# Altium schematic sheet suns_wifi_egse_top_connectors.SchDoc: Top
size A4; SheetNumber: 1; SheetTotal: 1
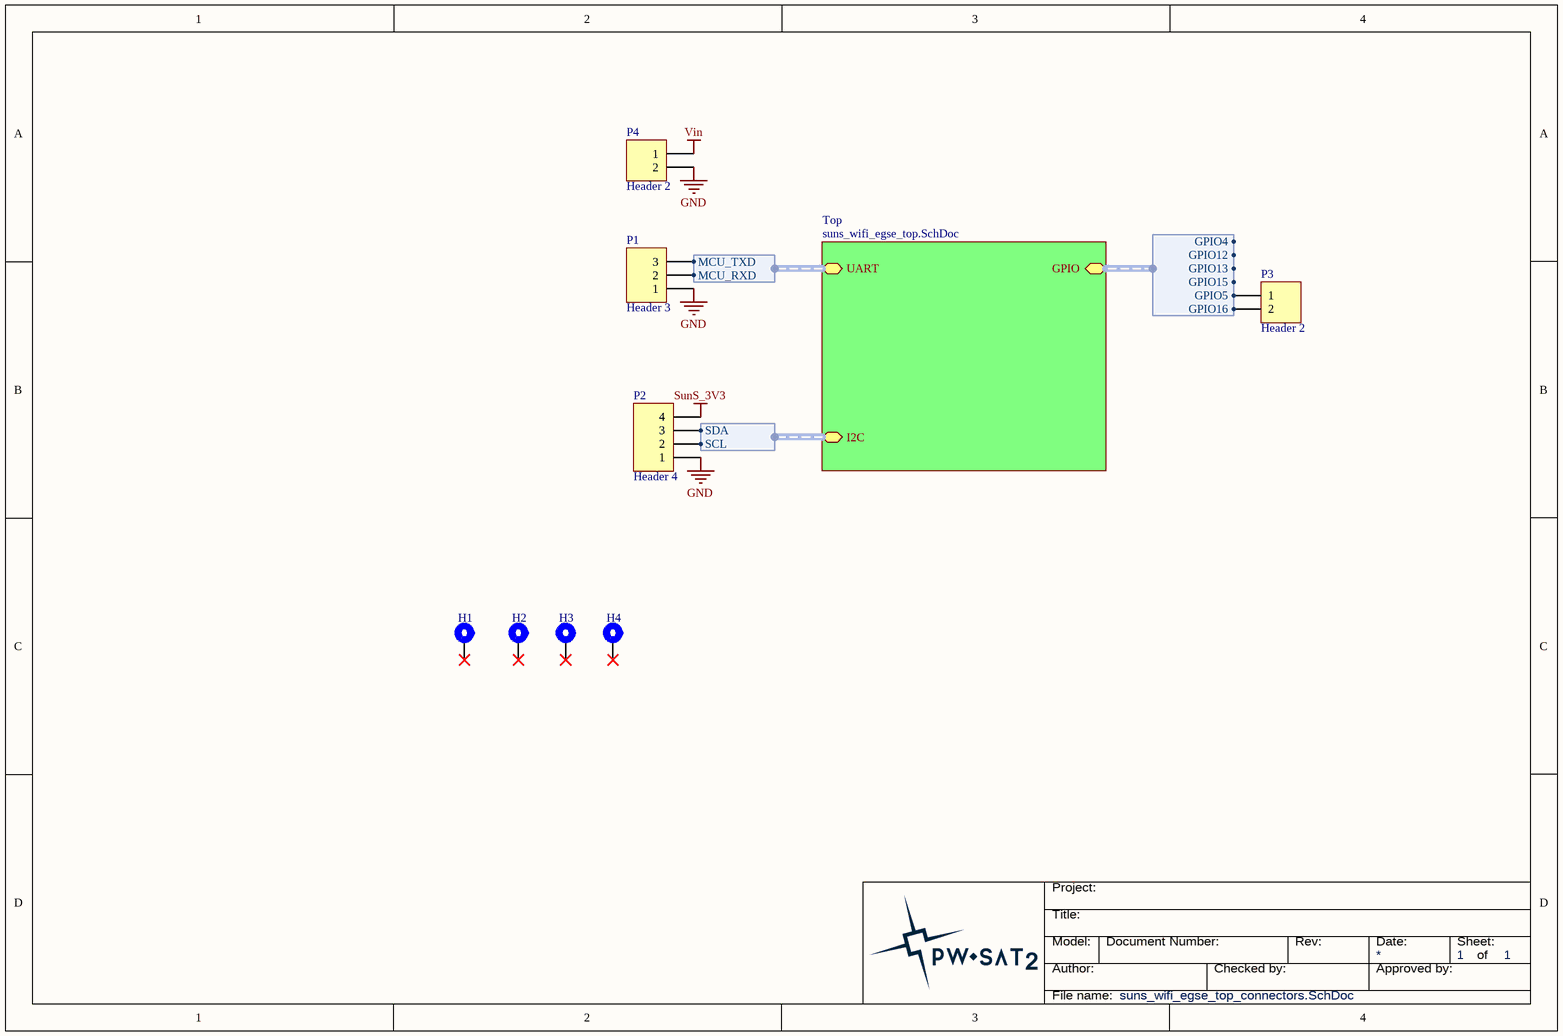
[diagram p0: suns_wifi_egse_top_connectors.SchDoc]

## Parts
H1  Mounting Hole  [PC-104_PcbMntHole_M3]  (value not drawn)
H2  Mounting Hole  [PC-104_PcbMntHole_M3]  (value not drawn)
H3  Mounting Hole  [PC-104_PcbMntHole_M3]  (value not drawn)
H4  Mounting Hole  [PC-104_PcbMntHole_M3]  (value not drawn)
P1  Header 3  [HEADER1X3H Male]
P2  Header 4  [HEADER 1X4H Male]
P3  Header 2  [HEADER 1X2H Male]
P4  Header 2  [HEADER 1X2H Male]

## Sub-sheets
Top = suns_wifi_egse_top.SchDoc: UART (harness UART), I2C (harness I2C), GPIO (harness GPIO)

## Harnesses
UART: MCU_RXD, MCU_TXD
I2C: SCL, SDA
GPIO: GPIO4, GPIO5, GPIO12, GPIO13, GPIO15, GPIO16

## Nets
GND: P1.1 P2.1 P4.2
SunS_3V3: P2.4
Vin: P4.1
NetP1_2: P1.2 ; sheet Top/UART.MCU_RXD
NetP1_3: P1.3 ; sheet Top/UART.MCU_TXD
NetP2_2: P2.2 ; sheet Top/I2C.SCL
NetP2_3: P2.3 ; sheet Top/I2C.SDA
NetP3_1: P3.1 ; sheet Top/GPIO.GPIO5
NetP3_2: P3.2 ; sheet Top/GPIO.GPIO16

Not connected (* = marked no-connect by the designer): H1 1*; H2 1*; H3 1*; H4 1*

## Notes on the sheet
- Title:
- Project:
- Author:
- Model:
- Document Number:
- Checked by:
- Rev:
- Date:
- Approved by:
- Sheet:
- of
- File name:

## Library data of the parts
H1-H4 = MntHole: PCB Mounting Hole; Value: Mounting Hole
P1 = Header 3: Header, 3-Pin; LatestRevisionDate: 17-Jul-2002; LatestRevisionNote: Re-released for DXP Platform.; Publisher: Altium Limited
P2 = Header 4: Header, 4-Pin; LatestRevisionDate: 17-Jul-2002; LatestRevisionNote: Re-released for DXP Platform.; Publisher: Altium Limited
P3 P4 = Header 2: Header, 2-Pin; LatestRevisionDate: 17-Jul-2002; LatestRevisionNote: Re-released for DXP Platform.; Publisher: Altium Limited